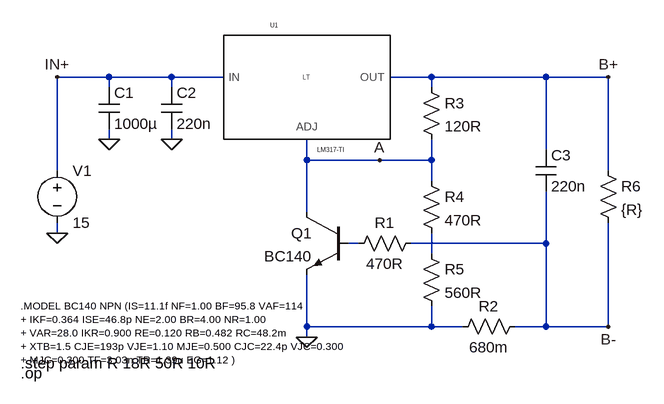
[diagram p0: schematic LM317 Acid Battery Charger.asc]
LM317 Acid Battery Charger.asc, the LTspice schematic file:
Version 4
SHEET 1 880 680
WIRE -96 96 -176 96
WIRE 0 96 -96 96
WIRE 80 96 0 96
WIRE 400 96 336 96
WIRE 576 96 400 96
WIRE 672 96 576 96
WIRE -96 112 -96 96
WIRE 0 112 0 96
WIRE 400 112 400 96
WIRE -96 192 -96 176
WIRE 0 192 0 176
WIRE 576 208 576 96
WIRE 208 224 208 192
WIRE 320 224 208 224
WIRE 400 224 400 192
WIRE 400 224 320 224
WIRE -176 240 -176 96
WIRE 672 240 672 96
WIRE 400 256 400 224
WIRE 208 304 208 224
WIRE -176 336 -176 320
WIRE 288 352 272 352
WIRE 576 352 576 272
WIRE 576 352 368 352
WIRE 400 368 400 336
WIRE 208 480 208 400
WIRE 400 480 400 448
WIRE 400 480 208 480
WIRE 448 480 400 480
WIRE 576 480 576 352
WIRE 576 480 528 480
WIRE 672 480 672 320
WIRE 672 480 576 480
WIRE 208 496 208 480
FLAG 208 496 0
FLAG 0 192 0
FLAG -96 192 0
FLAG -176 336 0
FLAG 672 96 B+
FLAG 672 480 B-
FLAG -176 96 IN+
FLAG 320 224 A
SYMBOL Regulators\\LM317-TI 208 96 R0
SYMATTR InstName U1
SYMBOL cap -112 112 R0
SYMATTR InstName C1
SYMATTR Value 1000µ
SYMBOL cap -16 112 R0
SYMATTR InstName C2
SYMATTR Value 220n
SYMBOL npn 272 304 M0
SYMATTR InstName Q1
SYMATTR Value BC140
SYMBOL cap 560 208 R0
SYMATTR InstName C3
SYMATTR Value 220n
SYMBOL res 384 336 R90
WINDOW 0 0 56 VBottom 2
WINDOW 3 32 56 VTop 2
SYMATTR InstName R1
SYMATTR Value 470R
SYMBOL res 544 464 R90
WINDOW 0 0 56 VBottom 2
WINDOW 3 32 56 VTop 2
SYMATTR InstName R2
SYMATTR Value 680m
SYMBOL res 384 96 R0
SYMATTR InstName R3
SYMATTR Value 120R
SYMBOL res 384 240 R0
SYMATTR InstName R4
SYMATTR Value 470R
SYMBOL res 384 352 R0
SYMATTR InstName R5
SYMATTR Value 560R
SYMBOL voltage -176 224 R0
WINDOW 123 0 0 Left 0
WINDOW 39 0 0 Left 0
SYMATTR InstName V1
SYMATTR Value 15
SYMBOL res 656 224 R0
SYMATTR InstName R6
SYMATTR Value {R}
TEXT -232 448 Left 1 !.MODEL BC140 NPN (IS=11.1f NF=1.00 BF=95.8 VAF=114\n+ IKF=0.364 ISE=46.8p NE=2.00 BR=4.00 NR=1.00\n+ VAR=28.0 IKR=0.900 RE=0.120 RB=0.482 RC=48.2m\n+ XTB=1.5 CJE=193p VJE=1.10 MJE=0.500 CJC=22.4p VJC=0.300\n+ MJC=0.300 TF=3.03n TR=1.39u EG=1.12 )
TEXT -232 552 Left 2 !.op
TEXT -232 536 Left 2 !.step param R 18R 50R 10R

The netlist it stands for:
* LM317 Acid Battery Charger.asc
XU1 IN+ A B+ LM317-TI  ; pins IN ADJ OUT
C1 IN+ 0 1000µ
C2 IN+ 0 220n
Q1 A N001 0 0 BC140
C3 B+ B- 220n
R1 B- N001 470R
R2 B- 0 680m
R3 B+ A 120R
R4 A N002 470R
R5 N002 0 560R
V1 IN+ 0 15
R6 B+ B- {R}
.model NPN NPN
.model PNP PNP
.lib standard.bjt
.MODEL BC140 NPN (IS=11.1f NF=1.00 BF=95.8 VAF=114
+ IKF=0.364 ISE=46.8p NE=2.00 BR=4.00 NR=1.00
+ VAR=28.0 IKR=0.900 RE=0.120 RB=0.482 RC=48.2m
+ XTB=1.5 CJE=193p VJE=1.10 MJE=0.500 CJC=22.4p VJC=0.300
+ MJC=0.300 TF=3.03n TR=1.39u EG=1.12 )
.op
.step param R 18R 50R 10R
.lib LM317-TI.LIB
.backanno
.end